# EasyEDA Pro project ESC-Player_KeyBoard_V04.epro

# Schematic Schematic2_1
Board Name: KeyBoard_V04; Create Date: 2025-04-19; Page Name: P1; Project Name: PcpRpi; Schematic Name: Schematic2_1; Update Date: 2025-04-19; Company: 嘉立创EDA; Page Size: A4; Version: V1.0
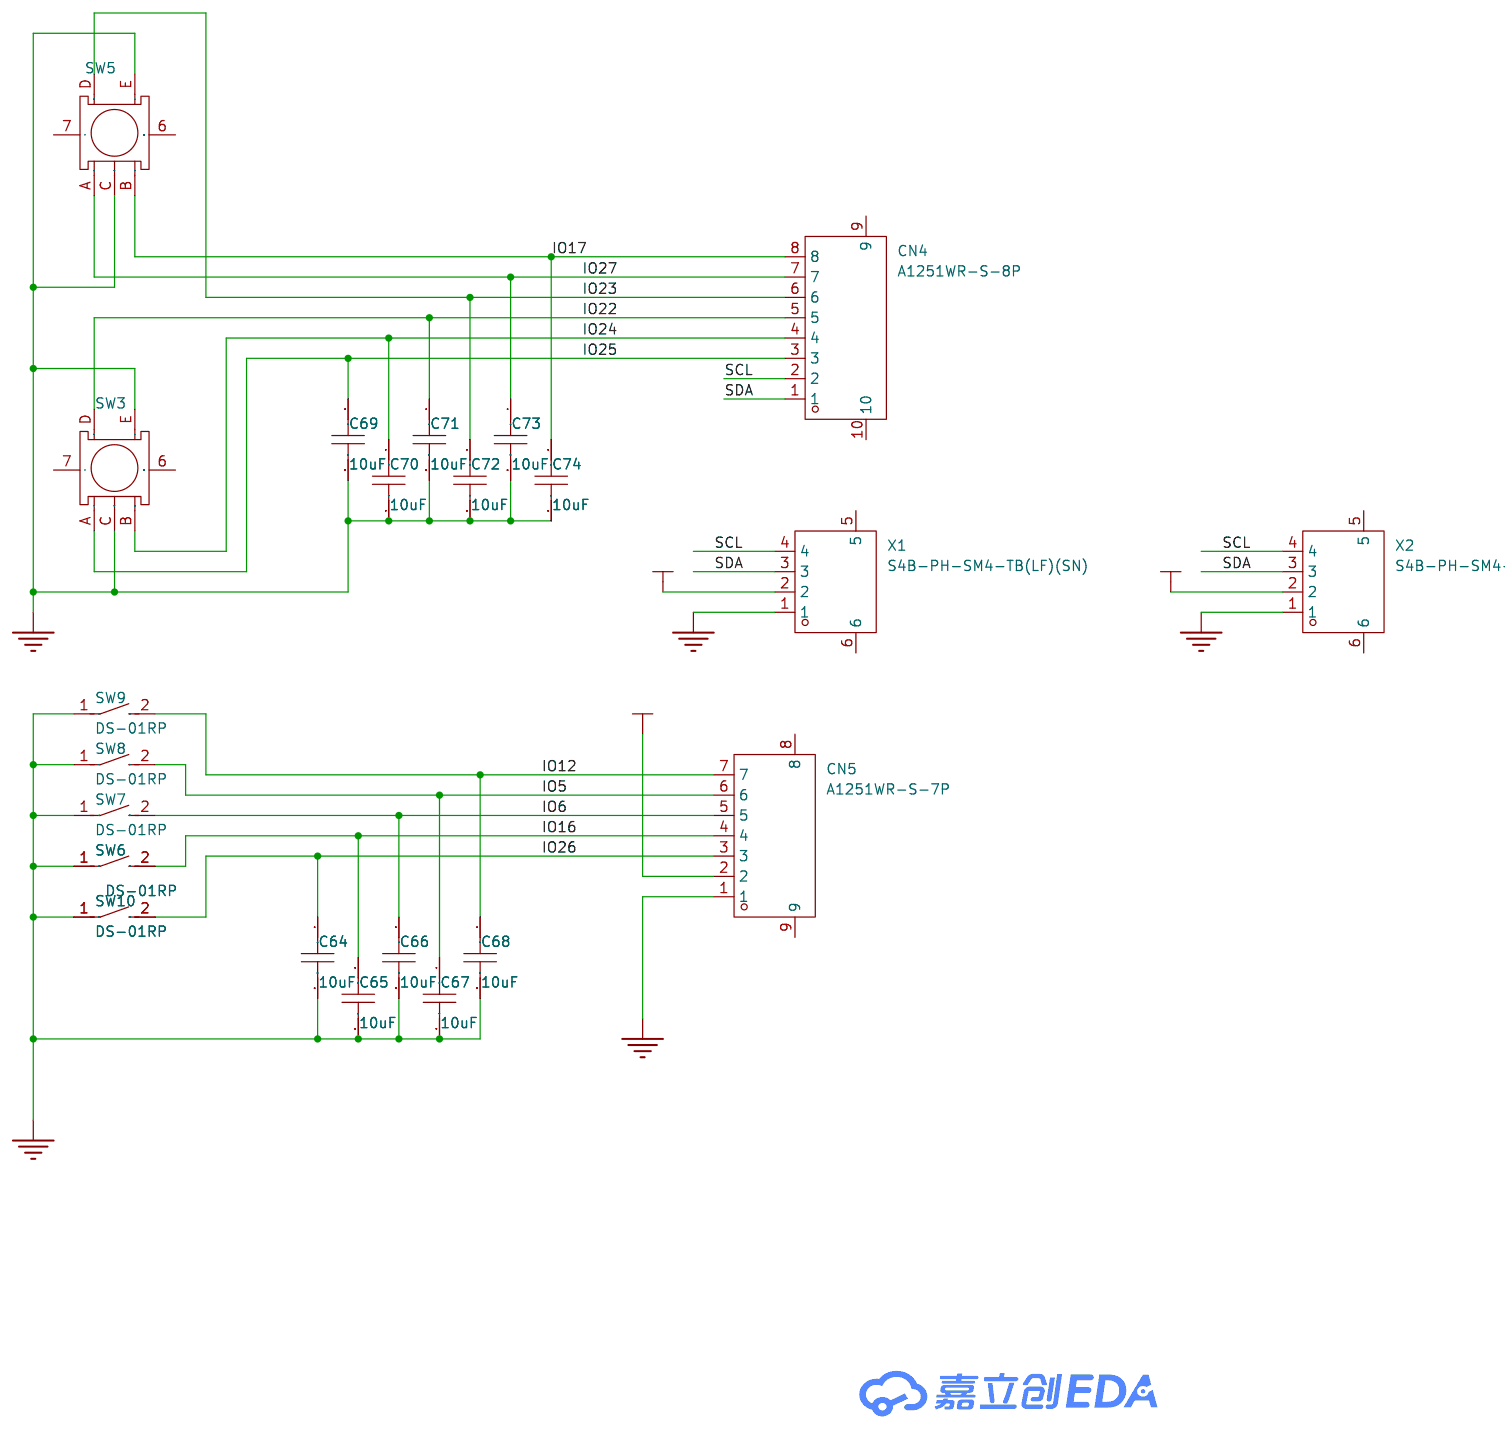
[diagram p0: schematic sheet]

## Parts
C64  10uF  [C0805]
C65  10uF  [C0805]
C66  10uF  [C0805]
C67  10uF  [C0805]
C68  10uF  [C0805]
C69  10uF  [C0805]
C70  10uF  [C0805]
C71  10uF  [C0805]
C72  10uF  [C0805]
C73  10uF  [C0805]
C74  10uF  [C0805]
CN4  A1251WR-S-8P  [CONN-SMD_A1251WR-S-8P]
CN5  A1251WR-S-7P  [CONN-SMD_A1251WR-S-7P]
SW3  -  [旋转编码器]
SW5  -  [旋转编码器]
SW6  DS-01RP  [key]
SW7  DS-01RP  [key]
SW8  DS-01RP  [key]
SW9  DS-01RP  [key]
SW10  DS-01RP  [key]
X1  S4B-PH-SM4-TB(LF)(SN)  [CONN-SMD_S4B-PH-SM4-TB-LF-SN]
X2  S4B-PH-SM4-TB(LF)(SN)  [CONN-SMD_S4B-PH-SM4-TB-LF-SN]

## Library data of the parts
C64-C74 = CL21A106KQFNNNE: 温度系数:X5R;额定电压:6.3V;精度:±10%;容值:10uF;; LCSC Part Name: 10uF(106) ±10% 6.3V; Supplier Part: C307525; Manufacturer: SAMSUNG(三星); Supplier Footprint: 0805; JLCPCB Part Class: Extended Part; Datasheet: https://atta.szlcsc.com/upload/public/pdf/source/20181009/C307525_56F628E2031BE35DC1A6FC1BF9D3FDBB.pdf; Supplier: LCSC; Temperature Coefficient: X5R; Voltage Rated: 6.3V; Tolerance: ±10%
CN4 = A1251WR-S-8P: 参考系列:-;间距:1.25mm;插针结构:1x8P;排数:1;每排PIN数:8;行距:-;安装方式:-;触头材质:磷青铜;; LCSC Part Name: MX1.25卧式贴片 镀锡 8P 针座连接器 镀锡; Supplier Part: C225117; Manufacturer: CJT(长江连接器); Supplier Footprint: SMD,P=1.25mm; JLCPCB Part Class: Extended Part; Datasheet: https://atta.szlcsc.com/upload/public/pdf/source/20180509/C225117_D5F4D71799B1C48B3D2F530BDEB28181.pdf; Supplier: LCSC; Pitch: 1.25mm; Pins Structure: 1x8P; Number of Rows: 1; Number of PINs Per Row: 8; Contact Material: 磷青铜
CN5 = A1251WR-S-7P: 参考系列:-;间距:1.25mm;插针结构:1x7P;排数:1;每排PIN数:7;行距:-;安装方式:-;触头材质:磷青铜;; LCSC Part Name: MX1.25卧式贴片 镀锡 7P 针座连接器; Supplier Part: C225116; Manufacturer: CJT(长江连接器); Supplier Footprint: SMD,P=1.25mm; JLCPCB Part Class: Extended Part; Datasheet: https://atta.szlcsc.com/upload/public/pdf/source/20180509/C225116_1193194061237BAC0FC2FBD9C148EEA9.pdf; Supplier: LCSC; Pitch: 1.25mm; Pins Structure: 1x7P; Number of Rows: 1; Number of PINs Per Row: 7; Contact Material: 磷青铜
SW3 SW5 = EC11E15244B2: Supplier Footprint: 插件
SW6-SW10 = DS-01RP: 类型:平拨，凸起式;额定电流:25mA;额定电压:24V;电路结构:单刀单掷;开关位数:1;引脚间距:-;工作温度:-20℃~+70℃;使用寿命:3000;颜色:红色;; LCSC Part Name: 红色1PIN立式直插正拨拨码开关; Supplier Part: C129059; Manufacturer: 韩国韩荣; Supplier Footprint: 插件; JLCPCB Part Class: Extended Part; Datasheet: https://atta.szlcsc.com/upload/public/pdf/source/20191118/C129059_51F1ED47ECA198F739F369D83343E373.pdf; Supplier: LCSC; Type: 平拨，凸起式; Current Rating: 25mA; Voltage Rating: 24V; Circuit: 单刀单掷; Number of Positions: 1; Operating Temperature: -20℃~+70℃; Operating Life: 3000; Color: 红色
X1 X2 = S4B-PH-SM4-TB(LF)(SN): 参考系列:PH;间距:2mm;插针结构:1x4P;排数:1;每排PIN数:4;行距:-;安装方式:-;触头材质:铜合金;; Supplier Part: C265102; Manufacturer: JST; Supplier Footprint: SMD,P=2mm; JLCPCB Part Class: Extended Part; Datasheet: https://atta.szlcsc.com/upload/public/pdf/source/20180829/C265102_2B408D0BD23562980F524E0F16A6C1B8.pdf; Supplier: LCSC; Reference Series: PH; Pitch: 2mm; Pins Structure: 1x4P; Number of Rows: 1; Number of PINs Per Row: 4; Contact Material: 铜合金

## Nets
5V: CN5.2 X1.2 X2.2
GND: C64.2 C65.2 C66.2 C67.2 C68.2 C69.2 C70.2 C71.2 C72.2 C73.2 C74.2 CN5.1 SW3.C SW3.E SW5.C SW5.E SW6.1 SW7.1 SW8.1 SW9.1 SW10.1 X1.1 X2.1
IO5: C67.1 CN5.6 SW8.2
IO6: C66.1 CN5.5 SW7.2
IO12: C68.1 CN5.7 SW9.2
IO16: C65.1 CN5.4 SW6.2
IO17: C74.1 CN4.8 SW5.B
IO22: C71.1 CN4.5 SW3.D
IO23: C72.1 CN4.6 SW5.D
IO24: C70.1 CN4.4 SW3.B
IO25: C69.1 CN4.3 SW3.A
IO26: C64.1 CN5.3 SW10.2
IO27: C73.1 CN4.7 SW5.A
SCL: CN4.2 X1.4 X2.4
SDA: CN4.1 X1.3 X2.3

Not connected (* = marked no-connect by the designer): CN4 9 10; CN5 8 9; SW3 6 7; SW5 6 7; X1 5 6; X2 5 6

# Board PCB2_1
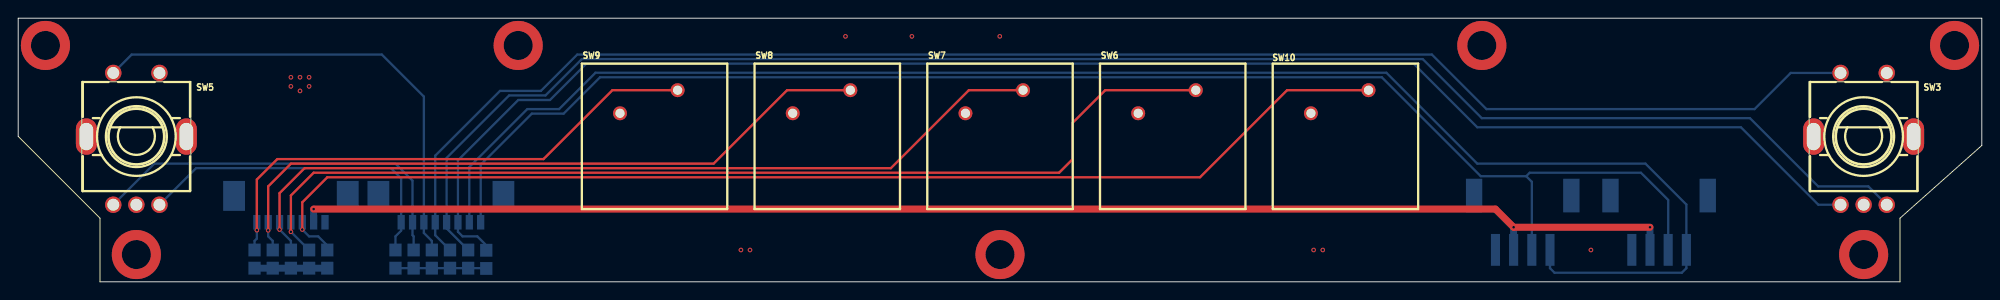
[diagram p1: board, top side]
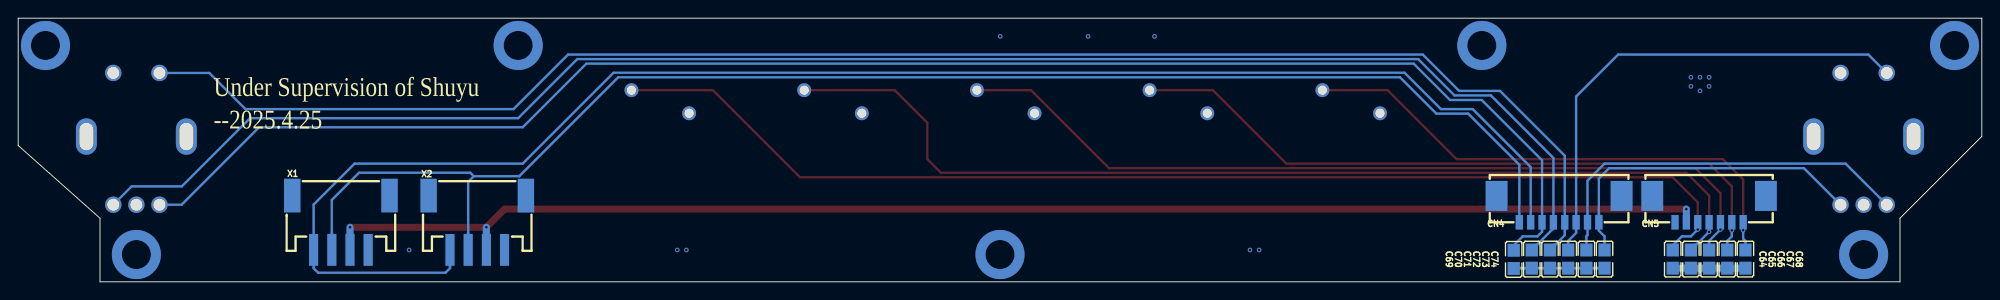
[diagram p2: board, bottom side, seen from below]

Outline 216 x 29 mm; copper layers: Top Layer, Bottom Layer. Coordinates in mm from the lower left corner of the outline.
Outline path: 0,29 0,16 9,7 9,0 207,0 207,7 216,15 216,29 0,29
Stack: Top Layer 0.035mm / Dielectric1 1.51mm FR4 er 4.5 / Bottom Layer 0.035mm

## Design rules (mm)
template: 自定义配置
spacing copperThickness1oz (default): track to track 0.102, other pairs 0.152 to 0.3
spacing copperThickness2oz: track to track 0.203, other pairs 0.152 to 0.3
track width copperThickness1oz (default): min 0.127, default 0.254, max 2.54
track width copperThickness2oz: min 0.203, default 0.254, max 2.54
differential pair differentialPair (default): width min 0.127, default 0.254, max 2.54; gap min 0.152, default 0.152
via viaSize (default): diameter min 0.5, default 0.61, max 10; hole min 0.3, default 0.305, max 6.3
net GND uses copperRegion1

## Placement (name value [footprint] x y rotation side)
C64  10uF  [C0805]  34 2.5 270 bottom
C65  10uF  [C0805]  32 2.5 270 bottom
C66  10uF  [C0805]  30 2.5 270 bottom
C67  10uF  [C0805]  28 2.5 270 bottom
C68  10uF  [C0805]  26 2.5 270 bottom
C69  10uF  [C0805]  51.49 2.47 270 bottom
C70  10uF  [C0805]  49.5 2.5 270 bottom
C71  10uF  [C0805]  47.5 2.5 270 bottom
C72  10uF  [C0805]  45.5 2.5 270 bottom
C73  10uF  [C0805]  43.5 2.5 270 bottom
C74  10uF  [C0805]  41.5 2.5 270 bottom
CN4  A1251WR-S-8P  [CONN-SMD_A1251WR-S-8P]  46.5 8 0 bottom
CN5  A1251WR-S-7P  [CONN-SMD_A1251WR-S-7P]  30 8 0 bottom
SW3  -  [旋转编码器]  203 16 0 top
SW5  -  [旋转编码器]  13 16 0 top
SW6  DS-01RP  [key]  127 16 0 top
SW7  DS-01RP  [key]  108 16 0 top
SW8  DS-01RP  [key]  89 16 0 top
SW9  DS-01RP  [key]  70 16 0 top
SW10  DS-01RP  [key]  146 16 0 top
X1  S4B-PH-SM4-TB(LF)(SN)  [CONN-SMD_S4B-PH-SM4-TB-LF-SN]  180.5 6.5 180 bottom
X2  S4B-PH-SM4-TB(LF)(SN)  [CONN-SMD_S4B-PH-SM4-TB-LF-SN]  165.5 6.5 180 bottom

## Footprints (pads in the part's own frame, mm; a bottom-side part is the same pattern mirrored in y, then rotated)
C0805
  rect 1.41x1.35 smd: 1(-1,0) 2(1,0)
CONN-SMD_A1251WR-S-7P
  rect 0.8x1.6 smd: 1(3.749,1.45) 2(2.499,1.45) 3(1.25,1.45) 4(0,1.45) 5(-1.25,1.45) 6(-2.499,1.45) 7(-3.749,1.45)
  rect 2.401x3.3 smd: 8(-6.251,-1.45) 9(6.251,-1.45)
CONN-SMD_A1251WR-S-8P
  rect 0.8x1.6 smd: 1(4.374,1.45) 2(3.124,1.45) 3(1.875,1.45) 4(0.625,1.45) 5(-0.625,1.45) 6(-1.875,1.45) 7(-3.124,1.45) 8(-4.374,1.45)
  rect 2.401x3.3 smd: 9(-6.876,-1.45) 10(6.876,-1.45)
CONN-SMD_S4B-PH-SM4-TB-LF-SN
  rect 1.001x3.5 smd: 1(2.999,-2.987) 2(1.001,-2.987) 3(-1.001,-2.987) 4(-2.999,-2.987)
  rect 1.801x3.701 smd: 5(-5.349,2.987) 6(5.349,2.987)
key
  round 1.524 hole 1: 1(-3.8,2.54) 2(2.54,5.08)
旋转编码器
  oval 2.301x4 hole 1.501x2.999: 6(5.499,-0.023) 7(-5.499,-0.023)
  round 1.801 hole 1.3: A(-2.54,-7.521) B(2.54,-7.521) C(0,-7.521) D(-2.54,6.977) E(2.54,6.977)

## Nets
As in the schematic.

Pads without a net: CN4 9 10; CN5 8 9; SW3 6 7; SW5 6 7; X1 5 6; X2 5 6

## Via types
v1: diameter 5.4, hole 3.2, Top Layer to Bottom Layer, 7 vias
v2: diameter 0.5, hole 0.3, Top Layer to Bottom Layer, 22 vias

## Routing (per net, layer and track width the routed paths; a pad name or vN(x,y) marks a point on that pad's centre or on a via; arc(x,y) is an arc through that point)
5V: length 154.3
  Top Layer w0.762: v2(179.5,6) v2(164.5,6) 162.5,8 v2(32.5,8)
  Bottom Layer w0.762: X1.2 v2(179.5,6) ; X2.2 v2(164.5,6) ; CN5.2 v2(32.5,8)
GND: length 18
  Bottom Layer w0.254: C74.2 C73.2 C72.2 C71.2 C70.2 51.46,1.5 C69.2
  Bottom Layer w0.762: C64.2 C65.2 C66.2 C67.2 C68.2
  vias: v2(30,22.5) v2(30,21.5) v2(31,22.5) v2(31,21) v2(32,22.5) v2(32,21.5) v2(79.5,3.5) v2(80.5,3.5) v2(91,27) v2(98.31,27) v2(107.98,27) v2(142.5,3.5) v2(143.5,3.5) v2(173,3.5)
(no net):
  vias: v1(3,26) v1(13,3) v1(55,26) v1(108,3) v1(161,26) v1(203,3) v1(213,26)
IO5: length 76.5
  Top Layer w0.254: v2(27.5,5.66) 27.5,10.5 30,13 76.5,13 84.58,21.08 SW8.2
  Bottom Layer w0.254: C67.1 28,4.5 27.5,5 v2(27.5,5.66) 27.5,6.55
IO6: length 94.1
  Top Layer w0.254: v2(28.75,5.75) 28.75,9.75 31.5,12.5 96,12.5 104.58,21.08 SW7.2
  Bottom Layer w0.254: CN5.5 v2(28.75,5.75) 30,4.5 C66.1
IO12: length 59.1
  Top Layer w0.254: v2(26.25,5.68) 26.25,11.25 28.5,13.5 57.78,13.5 65.36,21.08 SW9.2
  Bottom Layer w0.254: C68.1 26,4.5 26.25,4.75 v2(26.25,5.68) 26.25,6.55 CN5.7
IO16: length 114.6
  Top Layer w0.254: SW6.2 119.58,21.08 116,17.5 116,13.5 114.5,12 32.5,12 30,9.5 v2(30,5.5)
  Bottom Layer w0.254: CN5.4 v2(30,5.5) C65.1
IO17: length 36.9
  Bottom Layer w0.254: C74.1 41.5,5 42.13,5.63 CN4.8 42.13,11.37 41,12.5 19.56,12.5 SW5.B
IO22: length 174.4
  Bottom Layer w0.254: C71.1 45.88,5.12 CN4.5 45.88,13.88 53,21 57.5,21 61.5,25 155.51,25 161.51,19 191,19 194.98,22.98 SW3.D
IO23: length 54.2
  Bottom Layer w0.254: C72.1 45.5,4.5 44.63,5.37 CN4.6 44.63,20.37 40,25 12.48,25 SW5.D
IO24: length 180.7
  Bottom Layer w0.254: C70.1 47.12,5.88 CN4.4 47.12,13.62 54,20.5 58,20.5 62,24.5 154.5,24.5 161,18 190.5,18 198,10.5 203.52,10.5 SW3.B
IO25: length 175.1
  Bottom Layer w0.254: C69.1 51.49,4.01 50.5,5 48.87,5 48.37,5.5 CN4.3 48.37,13.37 55,20 58.5,20 62.5,24 153.5,24 160.5,17 189.5,17 198.02,8.48 SW3.A
IO26: length 130.2
  Top Layer w0.254: v2(31.25,5.75) 31.25,8.75 34,11.5 130,11.5 139.58,21.08 SW10.2
  Bottom Layer w0.254: C64.1 34,4 33,5 32,5 v2(31.25,5.75) CN5.3
IO27: length 43.2
  Bottom Layer w0.254: C73.1 43.5,5 43.38,5.12 CN4.7 43.38,11.12 41.5,13 14.98,13 SW5.A
SCL: length 174.7
  Bottom Layer w0.254: CN4.2 49.62,12.62 56,19 59.5,19 63.5,23 150.5,23 160.5,13 179,13 183.5,8.5 X1.4 183.5,1.5 183,1 169,1 168.5,1.5 X2.4
SDA: length 160.7
  Bottom Layer w0.254: X2.3 166.5,11 165.88,11.62 ; 165.88,11.62 160.88,11.62 150,22.5 64,22.5 60,18.5 56.5,18.5 50.87,12.87 CN4.1 ; 165.88,11.62 166.27,12 178.5,12 181.5,9 X1.3

## Copper pours and planes (outline as drawn; the poured copper is in the pictures)
GND on Top Layer: -7.5,40.5 221,40.5 221,-5.5 -7.5,-5.5
GND on Bottom Layer: -7.75,41.5 220.75,41.5 220.75,-4.5 -7.75,-4.5

Small or netless copper shapes (teardrops, artwork), in the pictures only: 11 on Top Layer, 55 on Bottom Layer

## Text on the board
Bottom Silkscreen Layer: Under Supervision of Shuyu / --2025.4.25
